# Altium schematic sheet 4_wiring drawing.SchDoc: Shaking control system
size A2; ApprovedBy: Approved By; CheckedBy: Sky Ma; DrawnBy: Jack; Address1: 1; Address2: 2; Address3: 3; Address4: 4; DocumentNumber: 04-TE-42-4015-0PA-A; Revision: A; SheetNumber: 5; SheetTotal: 6; SheetSize: A2; CheckedByDate: 2022-12-5; DrawByDate: 2022-12-5; SiteName: EMS TD Huangpu; ProjectName: 19205_BMW CCU DDR PCBA FT fixture wiring
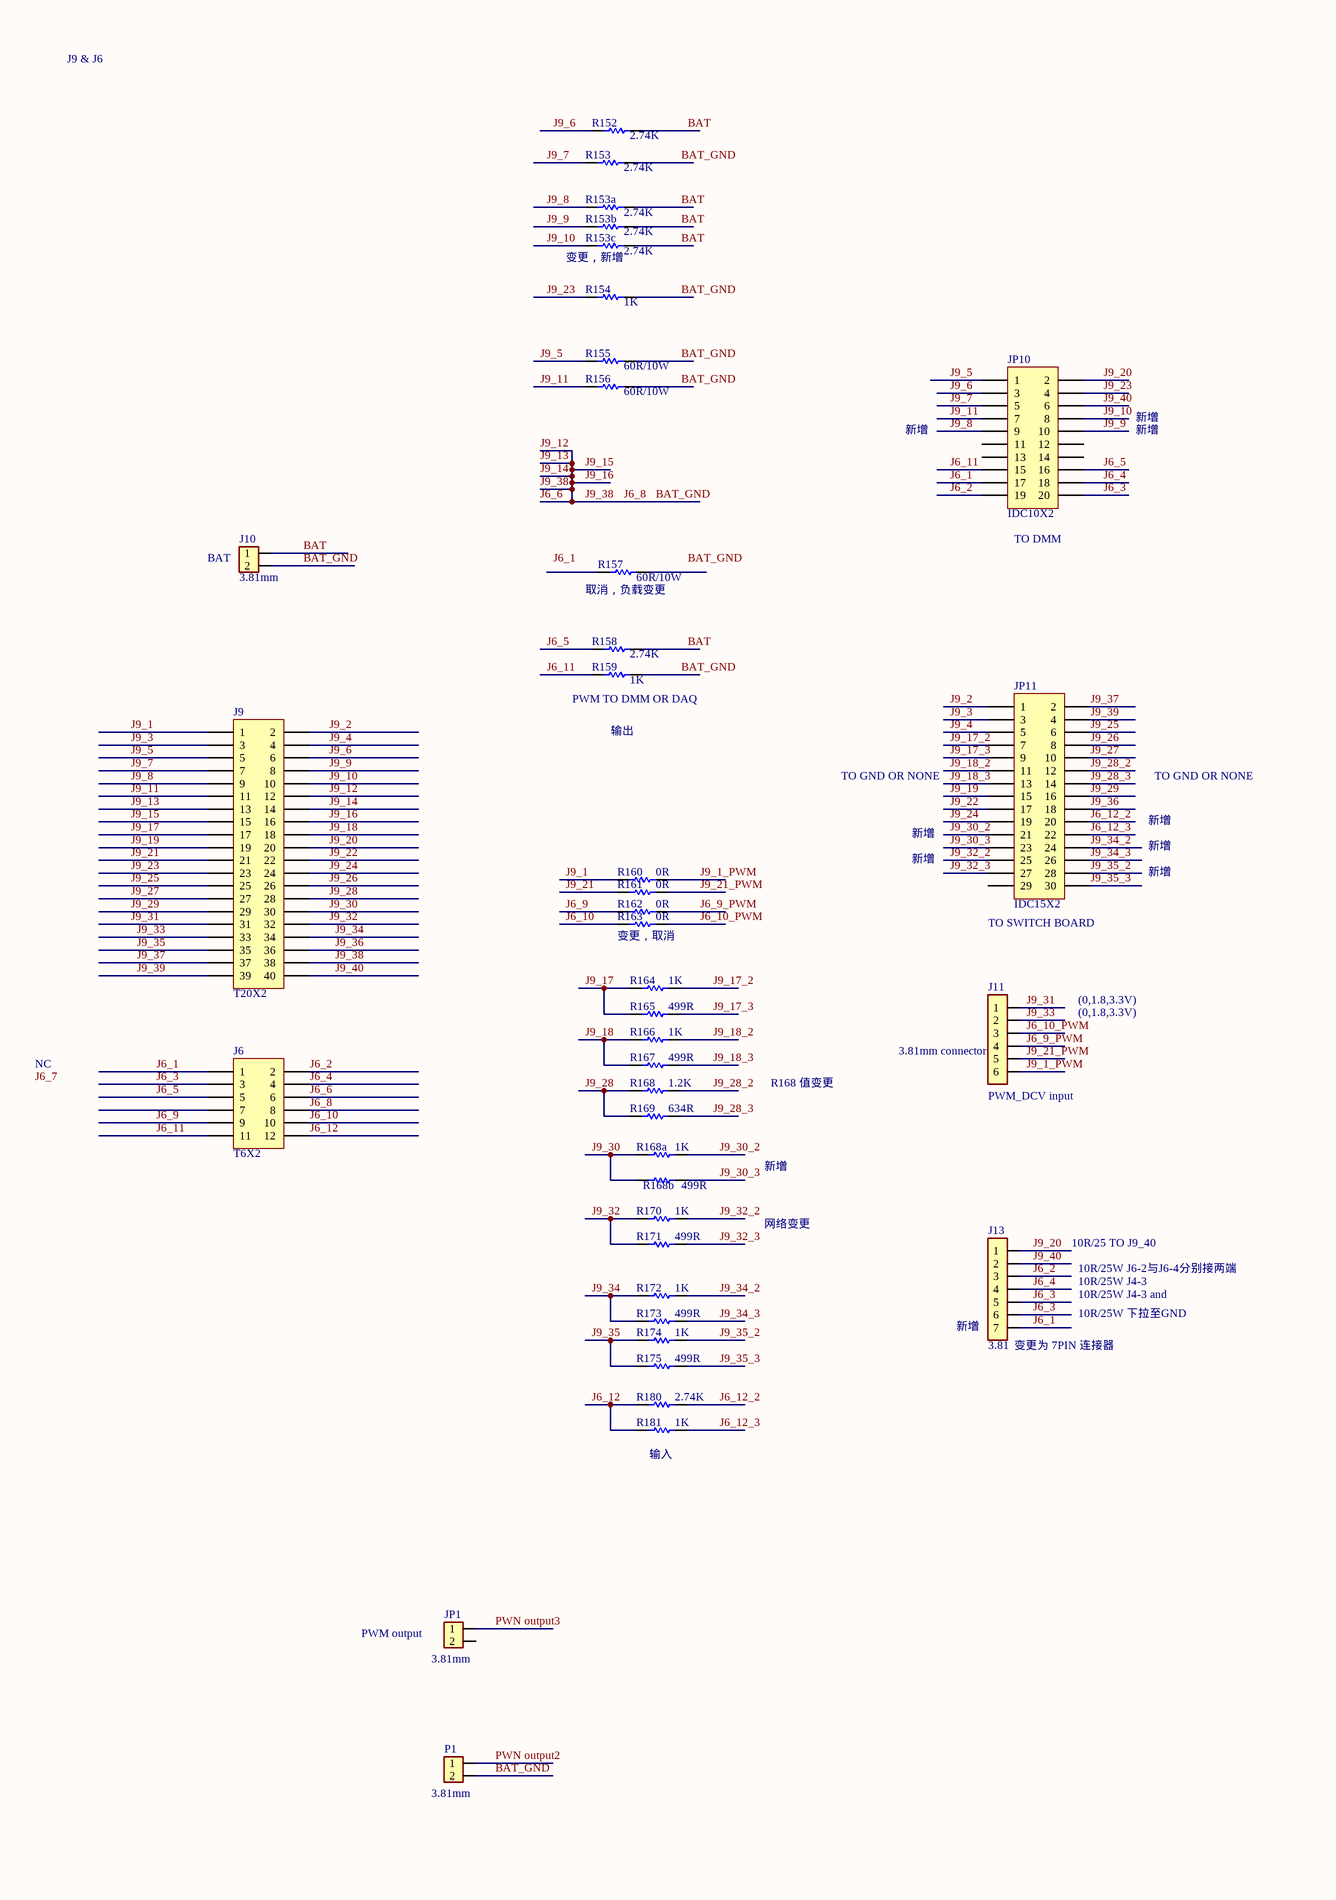
[diagram p0: 4_wiring drawing.SchDoc, left]
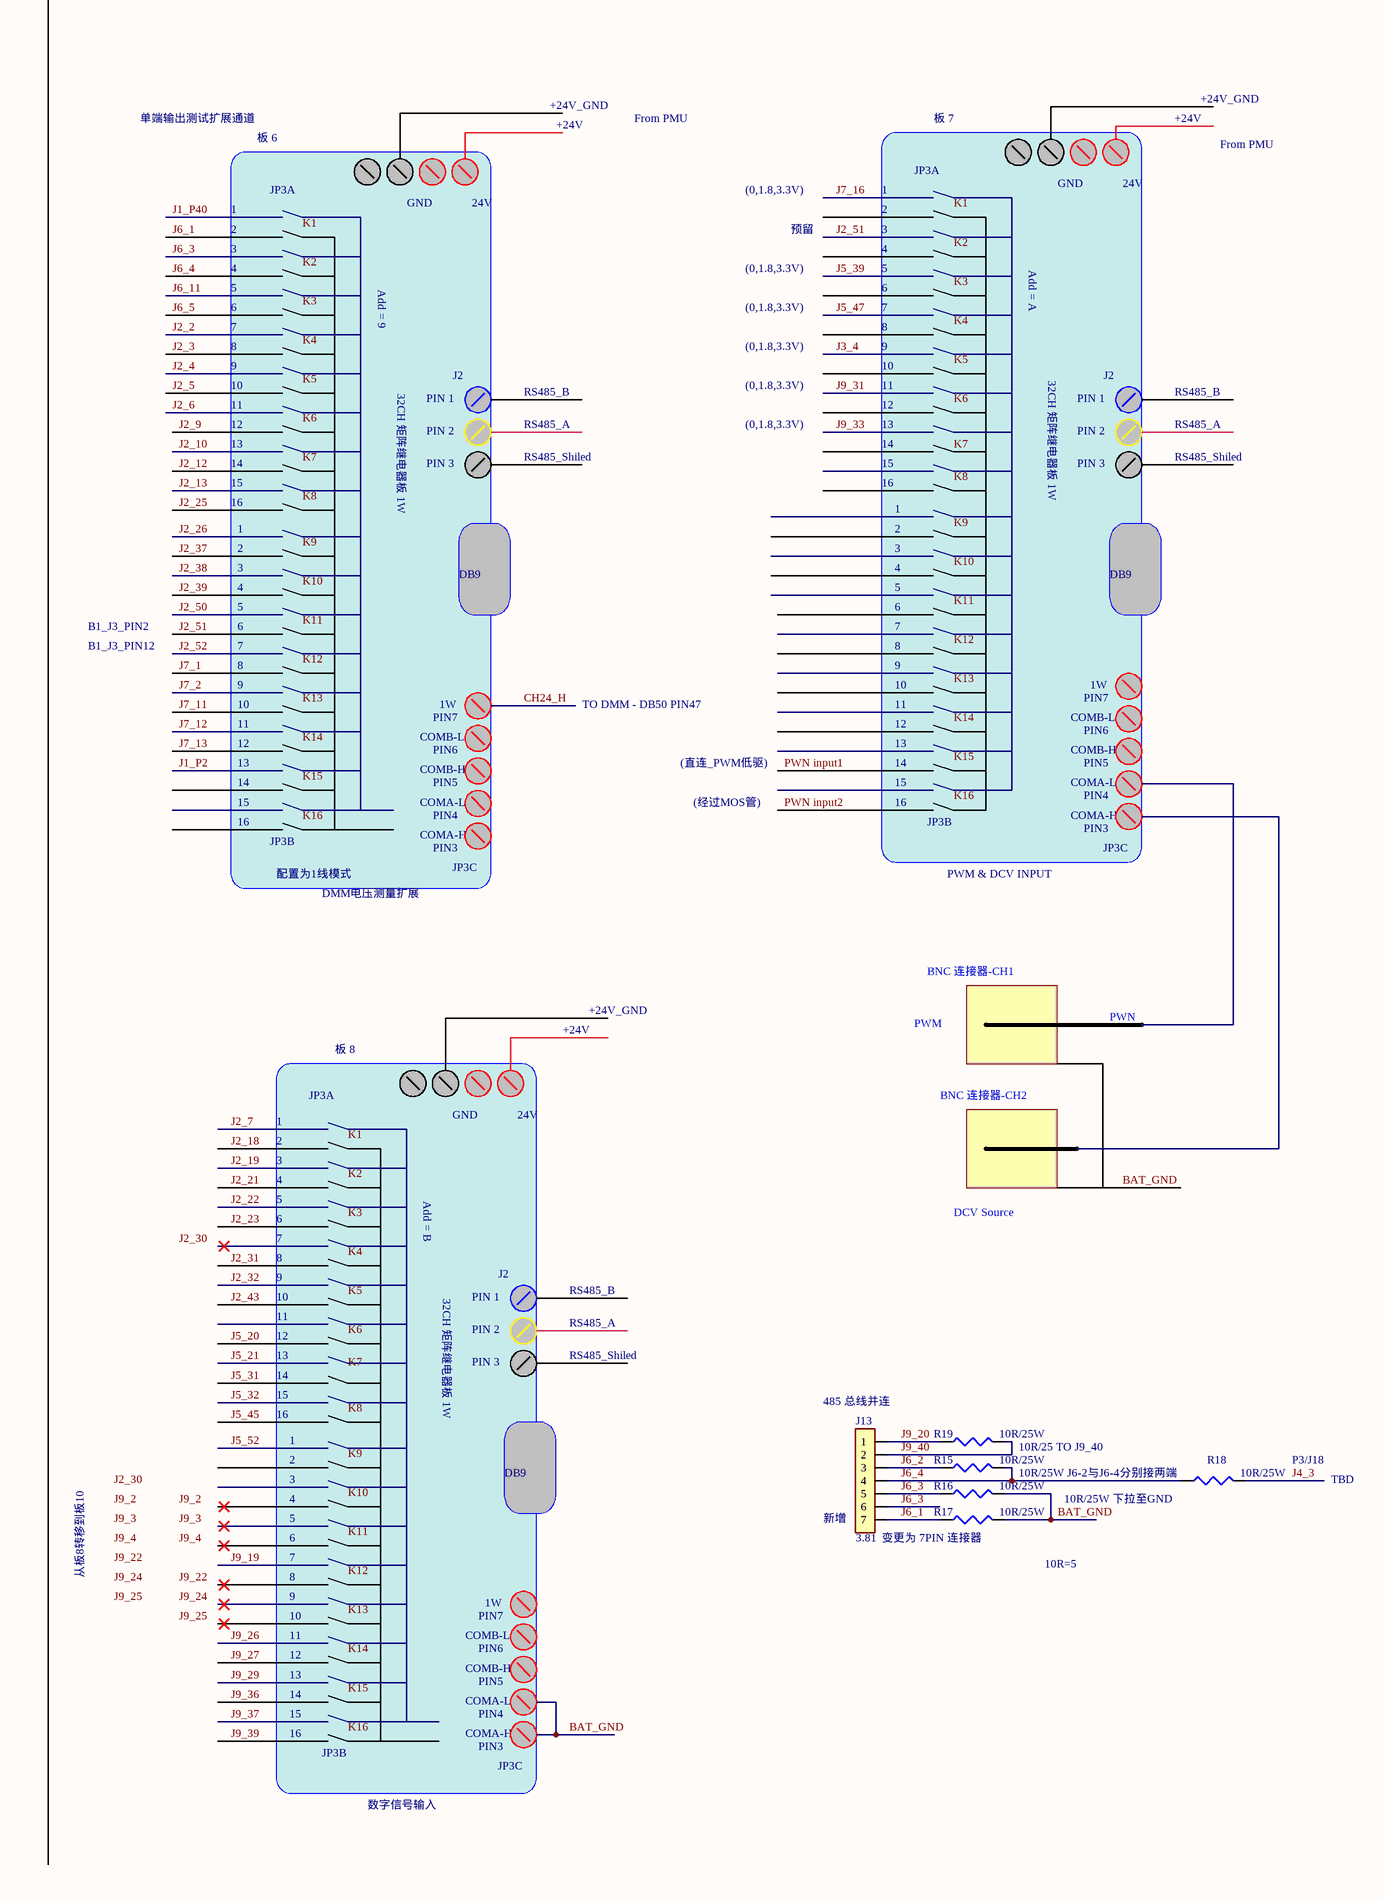
[diagram p1: 4_wiring drawing.SchDoc, right]

## Parts
(Parts that share a designator on the sheet are numbered #1, #2 ... from top to bottom, then left to right.)
J6  T6X2  [T6X2-bend]
J9  T20X2  [T20X2-bend]
J10  3.81mm  [3.81mm-2]
J11  3.81mm connector  [3.81mm-6]
J13#1  3.81  [3.96mm-7]
J13#2  3.81  [3.96mm-7]
JP1  3.81mm  [3.81mm-2]
JP10  IDC10X2  [IDC20]
JP11  IDC15X2  [IDC30]
P1  3.81mm  [3.81mm-2]
R15  10R/25W  [R AXIAL0.4]
R16  10R/25W  [R AXIAL0.4]
R17  10R/25W  [R AXIAL0.4]
R18  10R/25W  [R AXIAL0.4]
R19  10R/25W  [R AXIAL0.4]
R152  2.74K  [AXIAL-0.25W]
R153  2.74K  [AXIAL-0.25W]
R153a  2.74K  [AXIAL-0.25W]
R153b  2.74K  [AXIAL-0.25W]
R153c  2.74K  [AXIAL-0.25W]
R154  1K  [AXIAL-0.25W]
R155  60R/10W  [立式10W]
R156  60R/10W  [立式10W]
R157  60R/10W  [立式10W]
R158  2.74K  [AXIAL-0.25W]
R159  1K  [AXIAL-0.25W]
R160  0R  [AXIAL-0.25W]
R161  0R  [AXIAL-0.25W]
R162  0R  [AXIAL-0.25W]
R163  0R  [AXIAL-0.25W]
R164  1K  [AXIAL-0.25W]
R165  499R  [AXIAL-0.25W]
R166  1K  [AXIAL-0.25W]
R167  499R  [AXIAL-0.25W]
R168  1.2K  [AXIAL-0.25W]
R168a  1K  [AXIAL-0.25W]
R168b  499R  [AXIAL-0.25W]
R169  634R  [AXIAL-0.25W]
R170  1K  [AXIAL-0.25W]
R171  499R  [AXIAL-0.25W]
R172  1K  [AXIAL-0.25W]
R173  499R  [AXIAL-0.25W]
R174  1K  [AXIAL-0.25W]
R175  499R  [AXIAL-0.25W]
R180  2.74K  [AXIAL-0.25W]
R181  1K  [AXIAL-0.25W]

## Nets
BAT: J10.1 R152.2 R153a.2 R153b.2 R153c.2 R158.2
BAT_GND: J6.6 J6.8 J9.12 J9.13 J9.14 J9.15 J9.16 J9.38 J10.2 P1.2 R16.2 R17.2 R153.2 R154.2 R155.2 R156.2 R159.2  [also labelled J6_6, J6_8, J9_12, J9_13, J9_14, J9_15, J9_16, J9_38]
J4_3: R18.2
J6_1: J6.1 J13#1.7 J13#2.7 JP10.17 R17.1
J6_2: J6.2 J13#1.3 J13#2.3 JP10.19 R15.1
J6_3: J6.3 J13#1.5 J13#1.6 J13#2.5 J13#2.6 JP10.20 R16.1
J6_4: J6.4 J13#1.4 J13#2.4 JP10.18 R15.2 R18.1
J6_5: J6.5 JP10.16 R158.1
J6_9: J6.9 R162.1
J6_9_PWM: J11.4 R162.2
J6_10: J6.10 R163.1
J6_10_PWM: J11.3 R163.2
J6_11: J6.11 JP10.15 R159.1
J6_12: J6.12 R180.1 R181.1
J6_12_2: JP11.20 R180.2
J6_12_3: JP11.22 R181.2
J9_1: J9.1 R160.1
J9_1_PWM: J11.6 R160.2
J9_2: J9.2 JP11.1
J9_3: J9.3 JP11.3
J9_4: J9.4 JP11.5
J9_5: J9.5 JP10.1 R155.1
J9_6: J9.6 JP10.3 R152.1
J9_7: J9.7 JP10.5 R153.1
J9_8: J9.9 JP10.9 R153a.1
J9_9: J9.8 JP10.10 R153b.1
J9_10: J9.10 JP10.8 R153c.1
J9_11: J9.11 JP10.7 R156.1
J9_17: J9.17 R164.1 R165.1
J9_17_2: JP11.7 R164.2
J9_17_3: JP11.9 R165.2
J9_18: J9.18 R166.1 R167.1
J9_18_2: JP11.11 R166.2
J9_18_3: JP11.13 R167.2
J9_19: J9.19 JP11.15
J9_20: J9.20 J13#1.1 J13#2.1 JP10.2 R19.1
J9_21: J9.21 R161.1
J9_21_PWM: J11.5 R161.2
J9_22: J9.22 JP11.17
J9_23: J9.23 JP10.4 R154.1
J9_24: J9.24 JP11.19
J9_25: J9.25 JP11.6
J9_26: J9.26 JP11.8
J9_27: J9.27 JP11.10
J9_28: J9.28 R168.1 R169.1
J9_28_2: JP11.12 R168.2
J9_28_3: JP11.14 R169.2
J9_29: J9.29 JP11.16
J9_30: J9.30 R168a.1 R168b.1
J9_30_2: JP11.21 R168a.2
J9_30_3: JP11.23 R168b.2
J9_31: J9.31 J11.1
J9_32: J9.32 R170.1 R171.1
J9_32_2: JP11.25 R170.2
J9_32_3: JP11.27 R171.2
J9_33: J9.33 J11.2
J9_34: J9.34 R172.1 R173.1
J9_34_2: JP11.24 R172.2
J9_34_3: JP11.26 R173.2
J9_35: J9.35 R174.1 R175.1
J9_35_2: JP11.28 R174.2
J9_35_3: JP11.30 R175.2
J9_36: J9.36 JP11.18
J9_37: J9.37 JP11.2
J9_39: J9.39 JP11.4
J9_40: J9.40 J13#1.2 J13#2.2 JP10.6 R19.2
PWN output2: P1.1
PWN output3: JP1.1

Not connected (* = marked no-connect by the designer): J6 7; JP1 2; JP10 11 12 13 14; JP11 29; R157 1 2

## Notes on the sheet
- J9 & J6
- 单端输出测试扩展通道
- 板 6
- +24V_GND
- +24V
- From PMU
- 板 7
- (near R153c) 变更，新增
- JP3A
- (0,1.8,3.3V)
- 1
- GND
- 24V
- 2
- 3
- 4
- 预留
- 5
- Add = A
- 新增
- 6
- 7
- Add = 9
- 8
- 9
- 10
- 32CH 矩阵继电器板 1W
- PIN 1
- J2
- RS485_B
- 11
- (near JP10) TO DMM
- 12
- 13
- PIN 2
- RS485_A
- RS485_Shiled
- 14
- (near J10) BAT
- (near R157) 取消，负载变更
- 15
- 16
- PIN 3
- DB9
- (near R159) PWM TO DMM OR DAQ
- 输出
- B1_J3_PIN2
- B1_J3_PIN12
- TO GND OR NONE
- PIN7
- 1W
- TO DMM - DB50 PIN47
- COMB-L
- COMB-H
- PIN5
- PIN6
- (直连_PWM低驱)
- COMA-L
- (near JP11) TO SWITCH BOARD
- JP3B
- COMA-H
- PIN3
- PIN4
- (经过MOS管)
- JP3C
- (near R163) 变更，取消
- 配置为1线模式
- DMM电压测量扩展
- PWM & DCV INPUT
- BNC 连接器-CH1
- NC
- R168 值变更
- (near J11) PWM_DCV input
- 板 8
- PWM
- PWN
- BNC 连接器-CH2
- 网络变更
- 10R/25 TO J9_40
- 10R/25W J6-2与J6-4分别接两端
- 10R/25W J4-3
- 10R/25W J4-3 and
- 10R/25W 下拉至GND
- Add = B
- DCV Source
- (near J13#1) 新增
- (near J13#1) 变更为 7PIN 连接器
- (near R181) 输入
- (near J13#2) 485 总线并连
- P3/J18
- TBD
- (near JP1) PWM output
- 从板8转移到板10
- (near J13#2) 新增
- 变更为 7PIN 连接器
- 10R=5
- 数字信号输入
- Labels drawn without touching a wire or pin: BAT_GND, J1_P2, J1_P40, J2_2, J2_3, J2_4, J2_5, J2_6, J2_7, J2_9, J2_10, J2_12, J2_13, J2_18, J2_19, J2_21, J2_22, J2_23, J2_25, J2_26, J2_30, J2_31, J2_32, J2_37, J2_38, J2_39, J2_43, J2_50, J2_51, J2_52, J3_4, J5_20, J5_21, J5_31, J5_32, J5_39, J5_45, J5_47, J5_52, J6_1, J6_3, J6_4, J6_5, J6_7, J6_11, J7_1, J7_2, J7_11, J7_12, J7_13, J7_16, J9_2, J9_3, J9_4, J9_19, J9_22, J9_24, J9_25, J9_26, J9_27, J9_29, J9_31, J9_33, J9_36, J9_37, J9_39, K1, K2, K3, K4, K5, K6, K7, K8, K9, K10, K11, K12, K13, K14, K15, K16, PWN input1, PWN input2
- Document Number:
- Rev:
- Project Name:
- Drawn By:
- Date:
- Titile:
- Checked By:
- Sheet:
- Of

## Library data of the parts
J9 = IDC20X2
J10 JP1 P1 = CON2-3.81
J11 = CON6-3.81
J13#1 J13#2 = CON7-3.96
R15-R19 = RES2
R152 R153 R153a R153b R153c R154-R168 R168a R168b R169-R175 R180 R181 = RES1